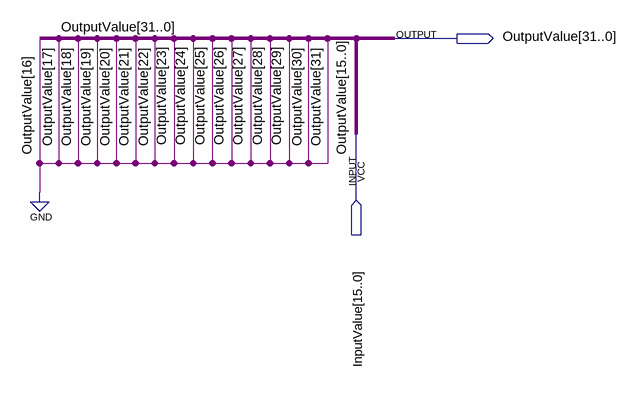
[diagram p0: schematic sheet]
// Quartus schematic ZeroExtensor.bdf as structural Verilog: 0 symbols, 2 pins
module ZeroExtensor (
  input  [15:0] InputValue,
  output [31:0] OutputValue
);


  assign OutputValue = {{16{1'b0}}, InputValue};
endmodule
